# Altium schematic sheet DD_Current_Sense.SchDoc
size A4; SheetNumber: 1; SheetTotal: 3
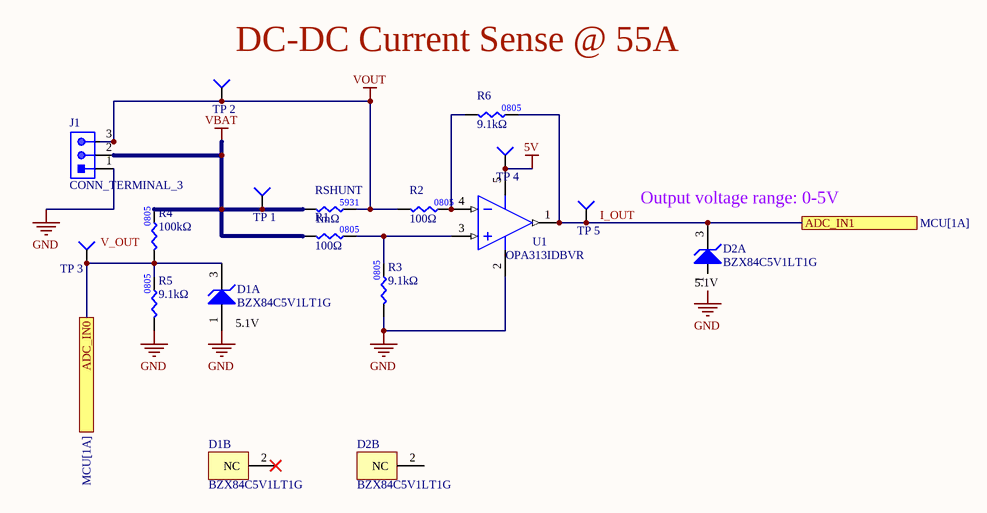
[diagram p0: DD_Current_Sense.SchDoc]

## Parts
D1  BZX84C5V1LT1G  [ONSC-SOT-23-3-318-08_V]  (parts A,B of 2)
D2  BZX84C5V1LT1G  [ONSC-SOT-23-3-318-08_V]  (parts A,B of 2)
J1  CONN_TERMINAL_3  [WJ127-5.0-3P]
R1  value 100Ω  [RES0805]  (hidden comment: RES_100Ω_0805_1%)
R2  value 100Ω  [RES0805]  (hidden comment: RES_100Ω_0805_1%)
R3  value 9.1kΩ  [RES0805]  (hidden comment: RES_9.1kΩ_0805_5%)
R4  value 100kΩ  [RES0805]  (hidden comment: RES_100kΩ_0805_0.5%)
R5  value 9.1kΩ  [RES0805]  (hidden comment: RES_9.1kΩ_0805_5%)
R6  value 9.1kΩ  [RES0805]  (hidden comment: RES_9.1kΩ_0805_5%)
RSHUNT  value 1mΩ  [RES-5931]  (hidden comment: RES_1mΩ_5931_1%)
TP_1  TESTPOINT_1MM_CIRCLE  [TESTPOINT_CIRCLE_1MM]  (value not drawn)  (no BOM)
TP_2  TESTPOINT_1MM_CIRCLE  [TESTPOINT_CIRCLE_1MM]  (value not drawn)  (no BOM)
TP_3  TESTPOINT_1MM_CIRCLE  [TESTPOINT_CIRCLE_1MM]  (value not drawn)  (no BOM)
TP_4  TESTPOINT_1MM_CIRCLE  [TESTPOINT_CIRCLE_1MM]  (value not drawn)  (no BOM)
TP_5  TESTPOINT_1MM_CIRCLE  [TESTPOINT_CIRCLE_1MM]  (value not drawn)  (no BOM)
U1  Manufacturer Part Number 1: OPA313IDBVR  [DBV0005A_M]  (hidden comment: OPAMP_OPA313IDBVR)

## Ports
ADC_IN0 (see MCU[1A]), ADC_IN1 (see MCU[1A])

## Nets
5V: TP_4.1(=value) U1.5(V+)
GND: D1.1(A) D2.1(A) J1.1 R3.1 R5.1 U1.2(V-)
VBAT: J1.2 R1.1 R4.2 RSHUNT.1 TP_1.1(=value)
VOUT: J1.3 R2.1 RSHUNT.2 TP_2.1(=value)
ADC_IN0: D1.3(K) R4.1 R5.2 TP_3.1(=value) ; port ADC_IN0
ADC_IN1: D2.3(K) R6.2 TP_5.1(=value) U1.1(OUT) ; port ADC_IN1
NetR1_2: R1.2 R3.2 U1.3(IN+)
NetR2_2: R2.2 R6.1 U1.4(IN-)

Not connected (* = marked no-connect by the designer): D1 2(NC)*; D2 2(NC)

## Notes on the sheet
- (near TP_2) DC-DC Current Sense @ 55A
- (near TP_5) I_OUT
- Output voltage range: 0-5V
- V_OUT
- (near D2) 5.1V
- (near D1) 5.1V
- (in symbol RES_100kΩ_0805_0.5%) 0805

## Library data of the parts
D1 D2 = CMP-1060-00946-1: Zener Voltage Regulator, 225 mW, 3-Pin SOT-23, Pb-Free, Tape and Reel; Manufacturer: On Semiconductor; Mounting Technology: Surface Mount; ComponentLink1URL: http://www.onsemi.com/; PartNumber: BZX84C5V1LT1G; DatasheetVersion: Rev. 17; PackageDescription: 3-Pin Small Outline Transistor, Body 2.92 x 1.3 mm, Pitch 0.95 mm; ComponentLink2Description: Datasheet; PackageVersion: Rev. AP, 11/2009; PackageReference: SOT-23-3-318-08; ComponentLink3Description: Package Specification; RoHS: Pb-Free; ComponentLink3URL: http://www.onsemi.cn/pub_link/Collateral/318-08.PDF; ComponentLink2URL: http://www.onsemi.com/pub_link/Collateral/BZX84C2V4LT1-D.PDF; Packing: Tape and Reel; ComponentLink1Description: Manufacturer URL
J1 = CONN_TERMINAL_3: Header, 3-Pin; Manufacturer 1: Ningbo Kangnex; LCSC Number: C8393; Manufaturer Part Number 1: WJ127-5.0-3P; Datasheet: https://datasheet.lcsc.com/lcsc/2107141401_Ningbo-Kangnex-Elec-WJ127-5-0-3P_C8393.pdf; Supplier 1: LCSC
R1 R2 = RES_100Ω_0805_1%: RES 100 OHM 1% 1/8W 0805; Manufacturer 1: Vishay Dale; Manufacturer Part Number 1: CRCW0805100RFKEA; Package/Footprint: 0805; Supplier 1: Digi-Key; Mounting Type: SMD; Supplier Part Number 1: 541-100CCT-ND; LCSC Part #: C1790
R3 R5 R6 = RES_9.1kΩ_0805_5%: RES 9.1K OHM 5% 1/8W 0805; Manufacturer 1: Yageo; Manufacturer Part Number 1: RC0805JR-079K1L; Supplier 1: Digi-Key; Supplier Part Number 1: 311-9.1KARCT-ND; Tolerance: 5%; Package: 0805
R4 = RES_100kΩ_0805_0.5%: RES 100K OHM 0.5% 1/8W 0805; Manufacturer 1: Panasonic; Manufacturer Part Number 1: ERA-6AED104V; Supplier 1: Digi-Key; Supplier Part Number 1: P123795CT-ND
RSHUNT = RES_1mΩ_5931_1%: RES 0.001 OHM 1% 10W 5931; Manufacturer 1: Vishay Dale; Manufacturer Part Number 1: WSLP59311L000FEA; Supplier Part Number 1: 541-10012-1-ND; Supplier 1: Digi-Key; Mounting Type: SMD; Package: 5931
TP_1-TP_5 = TESTPOINT_1MM_CIRCLE: TESTPOINT 1MM CIRCLE
U1 = OPAMP_OPA313IDBVR: IC OPAMP GP 1 CIRCUIT SOT23-5; Manufacturer 1: Texas Instruments; Package: SOT-23-5; Mounting Type: SMD; Supplier Part Number 1: 296-35607-1-ND; Supplier 1: Digi-Key; Verified: No